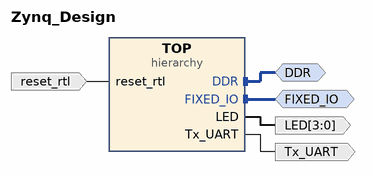
[diagram p0: block diagram of the top level]
# Vivado block design Zynq_Design, xc7z020clg400-1, Vivado 2019.1
create_bd_design Zynq_Design

create_bd_intf_port -mode Master -vlnv xilinx.com:interface:ddrx_rtl:1.0 DDR
create_bd_intf_port -mode Master -vlnv xilinx.com:display_processing_system7:fixedio_rtl:1.0 FIXED_IO
create_bd_port -dir I -type rst reset_rtl
create_bd_port -dir O -from 3 -to 0 LED
create_bd_port -dir O Tx_UART

create_bd_cell -type hier TOP

# ---- hierarchy /TOP ----
current_bd_instance /TOP
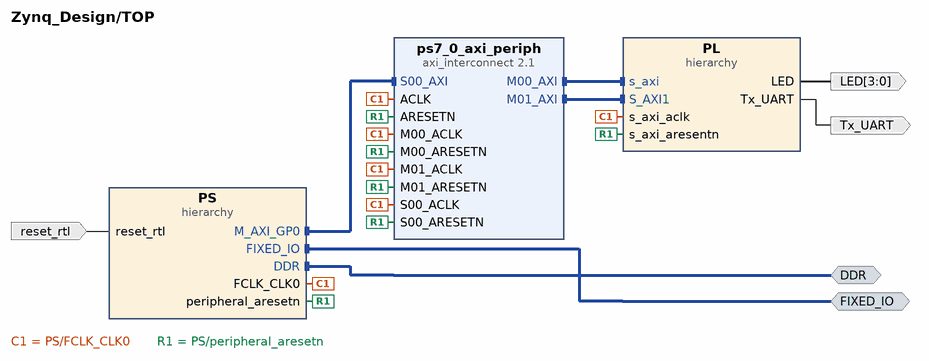
[diagram p1: block diagram inside /TOP]
create_bd_intf_pin -mode Master -vlnv xilinx.com:interface:ddrx_rtl:1.0 DDR
create_bd_intf_pin -mode Master -vlnv xilinx.com:display_processing_system7:fixedio_rtl:1.0 FIXED_IO
create_bd_pin -dir I -type rst reset_rtl
create_bd_pin -dir O Tx_UART
create_bd_pin -dir O -from 3 -to 0 LED

create_bd_cell -type hier PS
create_bd_cell -type hier PL
create_bd_cell -type ip -vlnv xilinx.com:ip:axi_interconnect:2.1 ps7_0_axi_periph
set_property -dict {CONFIG.NUM_MI 2 CONFIG.NUM_SI 1} [get_bd_cells ps7_0_axi_periph]

# ---- hierarchy /TOP/PS ----
current_bd_instance /TOP/PS
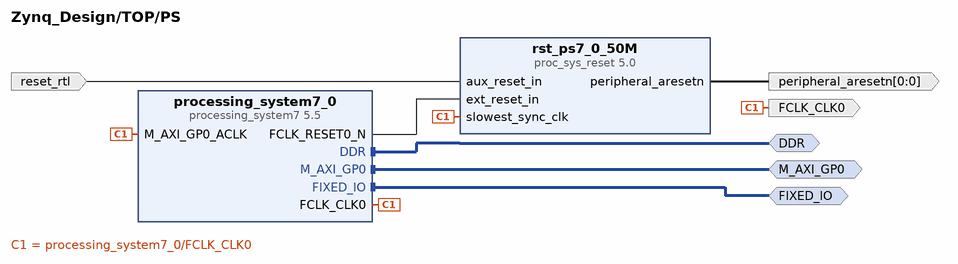
[diagram p2: block diagram inside /TOP/PS]
create_bd_intf_pin -mode Master -vlnv xilinx.com:interface:ddrx_rtl:1.0 DDR
create_bd_intf_pin -mode Master -vlnv xilinx.com:display_processing_system7:fixedio_rtl:1.0 FIXED_IO
create_bd_intf_pin -mode Master -vlnv xilinx.com:interface:aximm_rtl:1.0 M_AXI_GP0
create_bd_pin -dir I -type rst reset_rtl
create_bd_pin -dir O -from 0 -to 0 -type rst peripheral_aresetn
create_bd_pin -dir O -type clk FCLK_CLK0

create_bd_cell -type ip -vlnv xilinx.com:ip:proc_sys_reset:5.0 rst_ps7_0_50M
create_bd_cell -type ip -vlnv xilinx.com:ip:processing_system7:5.5 processing_system7_0
set_property -dict [list \
  CONFIG.PCW_APU_PERIPHERAL_FREQMHZ 667 \
  CONFIG.PCW_ENET0_PERIPHERAL_ENABLE 0 \
  CONFIG.PCW_FPGA0_PERIPHERAL_FREQMHZ 100 \
  CONFIG.PCW_GPIO_MIO_GPIO_ENABLE 1 \
  CONFIG.PCW_GPIO_MIO_GPIO_IO MIO \
  CONFIG.PCW_I2C_RESET_ENABLE 0 \
  CONFIG.PCW_PRESET_BANK1_VOLTAGE {LVCMOS 1.8V} \
  CONFIG.PCW_QSPI_GRP_FBCLK_ENABLE 1 \
  CONFIG.PCW_QSPI_GRP_FBCLK_IO {MIO 8} \
  CONFIG.PCW_QSPI_GRP_SINGLE_SS_ENABLE 1 \
  CONFIG.PCW_QSPI_GRP_SINGLE_SS_IO {MIO 1 .. 6} \
  CONFIG.PCW_QSPI_PERIPHERAL_ENABLE 1 \
  CONFIG.PCW_QSPI_QSPI_IO {MIO 1 .. 6} \
  CONFIG.PCW_SD0_GRP_CD_ENABLE 1 \
  CONFIG.PCW_SD0_GRP_CD_IO {MIO 47} \
  CONFIG.PCW_SD0_GRP_WP_ENABLE 0 \
  CONFIG.PCW_SD0_PERIPHERAL_ENABLE 1 \
  CONFIG.PCW_SD0_SD0_IO {MIO 40 .. 45} \
  CONFIG.PCW_SDIO_PERIPHERAL_FREQMHZ 50 \
  CONFIG.PCW_SINGLE_QSPI_DATA_MODE x4 \
  CONFIG.PCW_UART1_PERIPHERAL_ENABLE 1 \
  CONFIG.PCW_UART1_UART1_IO {MIO 48 .. 49} \
  CONFIG.PCW_UART_PERIPHERAL_FREQMHZ 100 \
  CONFIG.PCW_UIPARAM_DDR_FREQ_MHZ 533.333333 \
  CONFIG.PCW_UIPARAM_DDR_MEMORY_TYPE {DDR 3 (Low Voltage)} \
  CONFIG.PCW_UIPARAM_DDR_PARTNO {MT41K256M16 RE-125} \
  CONFIG.PCW_USB0_PERIPHERAL_ENABLE 1 \
  CONFIG.PCW_USB0_RESET_ENABLE 1 \
  CONFIG.PCW_USB0_RESET_IO {MIO 46} \
  CONFIG.PCW_USB0_USB0_IO {MIO 28 .. 39} \
  CONFIG.PCW_USB_RESET_ENABLE 1 \
  CONFIG.PCW_USB_RESET_SELECT {Share reset pin} \
] [get_bd_cells processing_system7_0]
# 297 more settings of processing_system7_0 are not shown: defaults, MIO pin electricals, DDR timing, and values the tool derives

# ---- hierarchy /TOP/PL ----
current_bd_instance /TOP/PL
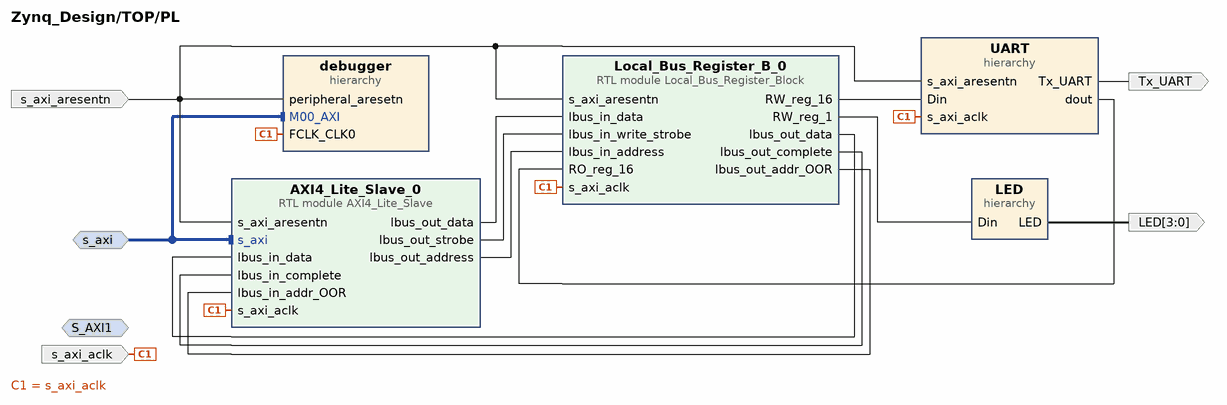
[diagram p3: block diagram inside /TOP/PL]
create_bd_intf_pin -mode Slave -vlnv xilinx.com:interface:aximm_rtl:1.0 s_axi
create_bd_intf_pin -mode Slave -vlnv xilinx.com:interface:aximm_rtl:1.0 S_AXI1
create_bd_pin -dir I -type clk s_axi_aclk
create_bd_pin -dir I s_axi_aresentn
create_bd_pin -dir O -from 3 -to 0 LED
create_bd_pin -dir O Tx_UART

create_bd_cell -type module -reference AXI4_Lite_Slave AXI4_Lite_Slave_0
create_bd_cell -type hier UART
create_bd_cell -type hier debugger
create_bd_cell -type hier LED
create_bd_cell -type module -reference Local_Bus_Register_Block Local_Bus_Register_B_0

# ---- hierarchy /TOP/PL/UART ----
current_bd_instance /TOP/PL/UART
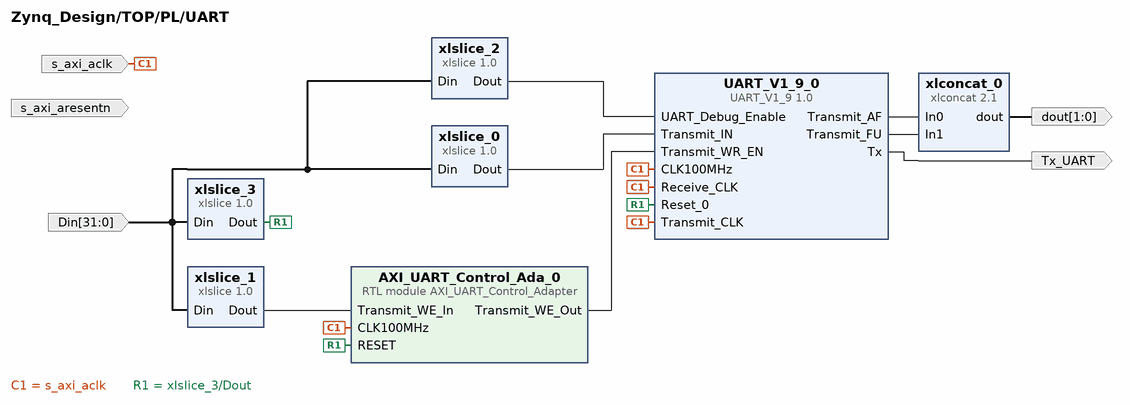
[diagram p4: block diagram inside /TOP/PL/UART]
create_bd_pin -dir I s_axi_aclk
create_bd_pin -dir I -type rst s_axi_aresentn
create_bd_pin -dir I -from 31 -to 0 Din
create_bd_pin -dir O Tx_UART
create_bd_pin -dir O -from 1 -to 0 dout

create_bd_cell -type ip -vlnv xilinx.com:user:UART_V1_9:1.0 UART_V1_9_0
create_bd_cell -type ip -vlnv xilinx.com:ip:xlslice:1.0 xlslice_0
set_property -dict {CONFIG.DIN_FROM 7 CONFIG.DOUT_WIDTH 8} [get_bd_cells xlslice_0]
create_bd_cell -type ip -vlnv xilinx.com:ip:xlslice:1.0 xlslice_1
set_property -dict {CONFIG.DIN_FROM 8 CONFIG.DIN_TO 8 CONFIG.DOUT_WIDTH 1} [get_bd_cells xlslice_1]
create_bd_cell -type ip -vlnv xilinx.com:ip:xlslice:1.0 xlslice_2
set_property -dict {CONFIG.DIN_FROM 31 CONFIG.DIN_TO 31 CONFIG.DOUT_WIDTH 1} [get_bd_cells xlslice_2]
create_bd_cell -type ip -vlnv xilinx.com:ip:xlslice:1.0 xlslice_3
set_property -dict {CONFIG.DIN_FROM 30 CONFIG.DIN_TO 30 CONFIG.DOUT_WIDTH 1} [get_bd_cells xlslice_3]
create_bd_cell -type module -reference AXI_UART_Control_Adapter AXI_UART_Control_Ada_0
create_bd_cell -type ip -vlnv xilinx.com:ip:xlconcat:2.1 xlconcat_0

# ---- hierarchy /TOP/PL/debugger ----
current_bd_instance /TOP/PL/debugger
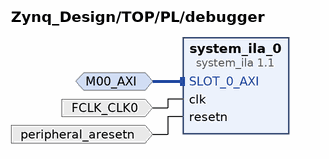
[diagram p5: block diagram inside /TOP/PL/debugger]
create_bd_intf_pin -mode Monitor -vlnv xilinx.com:interface:aximm_rtl:1.0 M00_AXI
create_bd_pin -dir I -type clk FCLK_CLK0
create_bd_pin -dir I -type rst peripheral_aresetn

create_bd_cell -type ip -vlnv xilinx.com:ip:system_ila:1.1 system_ila_0
set_property -dict [list \
  CONFIG.ALL_PROBE_SAME_MU_CNT 2 \
  CONFIG.C_DATA_DEPTH 2048 \
  CONFIG.C_EN_STRG_QUAL 1 \
  CONFIG.C_PROBE0_MU_CNT 2 \
] [get_bd_cells system_ila_0]

# ---- hierarchy /TOP/PL/LED ----
current_bd_instance /TOP/PL/LED
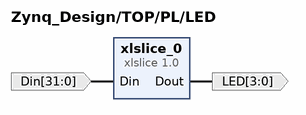
[diagram p6: block diagram inside /TOP/PL/LED]
create_bd_pin -dir I -from 31 -to 0 Din
create_bd_pin -dir O -from 3 -to 0 LED

create_bd_cell -type ip -vlnv xilinx.com:ip:xlslice:1.0 xlslice_0
set_property -dict {CONFIG.DIN_FROM 3 CONFIG.DOUT_WIDTH 4} [get_bd_cells xlslice_0]

# ---- connections ----

current_bd_instance /TOP
connect_bd_intf_net [get_bd_intf_pins FIXED_IO] [get_bd_intf_pins PS/FIXED_IO]
connect_bd_intf_net [get_bd_intf_pins DDR] [get_bd_intf_pins PS/DDR]
connect_bd_intf_net [get_bd_intf_pins PL/s_axi] [get_bd_intf_pins ps7_0_axi_periph/M00_AXI]
connect_bd_intf_net [get_bd_intf_pins ps7_0_axi_periph/S00_AXI] [get_bd_intf_pins PS/M_AXI_GP0]
connect_bd_intf_net -intf_net S_AXI1_1 [get_bd_intf_pins PL/S_AXI1] [get_bd_intf_pins ps7_0_axi_periph/M01_AXI]
connect_bd_net [get_bd_pins reset_rtl] [get_bd_pins PS/reset_rtl]
connect_bd_net [get_bd_pins PL/Tx_UART] [get_bd_pins Tx_UART]
connect_bd_net [get_bd_pins PL/LED] [get_bd_pins LED]
connect_bd_net [get_bd_pins PS/FCLK_CLK0] \
  [get_bd_pins PL/s_axi_aclk] [get_bd_pins ps7_0_axi_periph/M00_ACLK] [get_bd_pins ps7_0_axi_periph/S00_ACLK] \
  [get_bd_pins ps7_0_axi_periph/M01_ACLK] [get_bd_pins ps7_0_axi_periph/ACLK]
connect_bd_net [get_bd_pins PS/peripheral_aresetn] \
  [get_bd_pins PL/s_axi_aresentn] [get_bd_pins ps7_0_axi_periph/M00_ARESETN] [get_bd_pins ps7_0_axi_periph/S00_ARESETN] \
  [get_bd_pins ps7_0_axi_periph/M01_ARESETN] [get_bd_pins ps7_0_axi_periph/ARESETN]

current_bd_instance /TOP/PS
connect_bd_intf_net [get_bd_intf_pins M_AXI_GP0] [get_bd_intf_pins processing_system7_0/M_AXI_GP0]
connect_bd_intf_net [get_bd_intf_pins DDR] [get_bd_intf_pins processing_system7_0/DDR]
connect_bd_intf_net [get_bd_intf_pins FIXED_IO] [get_bd_intf_pins processing_system7_0/FIXED_IO]
connect_bd_net -net slowest_sync_clk_1 [get_bd_pins processing_system7_0/FCLK_CLK0] \
  [get_bd_pins rst_ps7_0_50M/slowest_sync_clk] [get_bd_pins processing_system7_0/M_AXI_GP0_ACLK] [get_bd_pins FCLK_CLK0]
connect_bd_net [get_bd_pins reset_rtl] [get_bd_pins rst_ps7_0_50M/aux_reset_in]
connect_bd_net [get_bd_pins rst_ps7_0_50M/peripheral_aresetn] [get_bd_pins peripheral_aresetn]
connect_bd_net [get_bd_pins processing_system7_0/FCLK_RESET0_N] [get_bd_pins rst_ps7_0_50M/ext_reset_in]

current_bd_instance /TOP/PL
connect_bd_intf_net [get_bd_intf_pins s_axi] [get_bd_intf_pins AXI4_Lite_Slave_0/s_axi]
connect_bd_intf_net [get_bd_intf_pins s_axi] [get_bd_intf_pins debugger/M00_AXI]
connect_bd_net [get_bd_pins s_axi_aclk] \
  [get_bd_pins AXI4_Lite_Slave_0/s_axi_aclk] [get_bd_pins UART/s_axi_aclk] [get_bd_pins debugger/FCLK_CLK0] \
  [get_bd_pins Local_Bus_Register_B_0/s_axi_aclk]
connect_bd_net [get_bd_pins s_axi_aresentn] \
  [get_bd_pins AXI4_Lite_Slave_0/s_axi_aresentn] [get_bd_pins UART/s_axi_aresentn] [get_bd_pins debugger/peripheral_aresetn] \
  [get_bd_pins Local_Bus_Register_B_0/s_axi_aresentn]
connect_bd_net [get_bd_pins AXI4_Lite_Slave_0/lbus_out_data] [get_bd_pins Local_Bus_Register_B_0/lbus_in_data]
connect_bd_net [get_bd_pins AXI4_Lite_Slave_0/lbus_out_strobe] [get_bd_pins Local_Bus_Register_B_0/lbus_in_write_strobe]
connect_bd_net [get_bd_pins AXI4_Lite_Slave_0/lbus_out_address] [get_bd_pins Local_Bus_Register_B_0/lbus_in_address]
connect_bd_net [get_bd_pins Local_Bus_Register_B_0/lbus_out_data] [get_bd_pins AXI4_Lite_Slave_0/lbus_in_data]
connect_bd_net -net Local_Bus_Register_B_0_lbus_out_op_success [get_bd_pins Local_Bus_Register_B_0/lbus_out_complete] \
  [get_bd_pins AXI4_Lite_Slave_0/lbus_in_complete]
connect_bd_net [get_bd_pins Local_Bus_Register_B_0/lbus_out_addr_OOR] [get_bd_pins AXI4_Lite_Slave_0/lbus_in_addr_OOR]
connect_bd_net [get_bd_pins Local_Bus_Register_B_0/RW_reg_1] [get_bd_pins LED/Din]
connect_bd_net -net xlslice_0_Dout [get_bd_pins LED/LED] [get_bd_pins LED]
connect_bd_net [get_bd_pins Local_Bus_Register_B_0/RW_reg_16] [get_bd_pins UART/Din]
connect_bd_net [get_bd_pins UART/Tx_UART] [get_bd_pins Tx_UART]
connect_bd_net [get_bd_pins UART/dout] [get_bd_pins Local_Bus_Register_B_0/RO_reg_16]

current_bd_instance /TOP/PL/UART
connect_bd_net [get_bd_pins s_axi_aclk] \
  [get_bd_pins UART_V1_9_0/CLK100MHz] [get_bd_pins UART_V1_9_0/Receive_CLK] [get_bd_pins UART_V1_9_0/Transmit_CLK] \
  [get_bd_pins AXI_UART_Control_Ada_0/CLK100MHz]
connect_bd_net [get_bd_pins Din] [get_bd_pins xlslice_0/Din] [get_bd_pins xlslice_1/Din] [get_bd_pins xlslice_2/Din] [get_bd_pins xlslice_3/Din]
connect_bd_net [get_bd_pins xlslice_2/Dout] [get_bd_pins UART_V1_9_0/UART_Debug_Enable]
connect_bd_net [get_bd_pins xlslice_3/Dout] [get_bd_pins UART_V1_9_0/Reset_0] [get_bd_pins AXI_UART_Control_Ada_0/RESET]
connect_bd_net [get_bd_pins UART_V1_9_0/Tx] [get_bd_pins Tx_UART]
connect_bd_net [get_bd_pins xlslice_0/Dout] [get_bd_pins UART_V1_9_0/Transmit_IN]
connect_bd_net [get_bd_pins xlslice_1/Dout] [get_bd_pins AXI_UART_Control_Ada_0/Transmit_WE_In]
connect_bd_net [get_bd_pins AXI_UART_Control_Ada_0/Transmit_WE_Out] [get_bd_pins UART_V1_9_0/Transmit_WR_EN]
connect_bd_net [get_bd_pins UART_V1_9_0/Transmit_AF] [get_bd_pins xlconcat_0/In0]
connect_bd_net [get_bd_pins UART_V1_9_0/Transmit_FU] [get_bd_pins xlconcat_0/In1]
connect_bd_net [get_bd_pins xlconcat_0/dout] [get_bd_pins dout]

current_bd_instance /TOP/PL/debugger
connect_bd_intf_net [get_bd_intf_pins system_ila_0/SLOT_0_AXI] [get_bd_intf_pins M00_AXI]
connect_bd_net -net FCLK_CLK0_1 [get_bd_pins FCLK_CLK0] [get_bd_pins system_ila_0/clk]
connect_bd_net [get_bd_pins peripheral_aresetn] [get_bd_pins system_ila_0/resetn]

current_bd_instance /TOP/PL/LED
connect_bd_net -net Local_Bus_Register_B_0_RW_reg_1 [get_bd_pins Din] [get_bd_pins xlslice_0/Din]
connect_bd_net [get_bd_pins xlslice_0/Dout] [get_bd_pins LED]

current_bd_instance /
connect_bd_intf_net [get_bd_intf_ports DDR] [get_bd_intf_pins TOP/DDR]
connect_bd_intf_net [get_bd_intf_ports FIXED_IO] [get_bd_intf_pins TOP/FIXED_IO]
connect_bd_net [get_bd_ports reset_rtl] [get_bd_pins TOP/reset_rtl]
connect_bd_net [get_bd_pins TOP/Tx_UART] [get_bd_ports Tx_UART]
connect_bd_net [get_bd_pins TOP/LED] [get_bd_ports LED]

# ---- address map ----
assign_bd_address -offset 0x43C00000 -range 4K -target_address_space [get_bd_addr_spaces TOP/PS/processing_system7_0/Data] [get_bd_addr_segs TOP/PL/AXI4_Lite_Slave_0/s_axi/reg0]

validate_bd_design
save_bd_design
